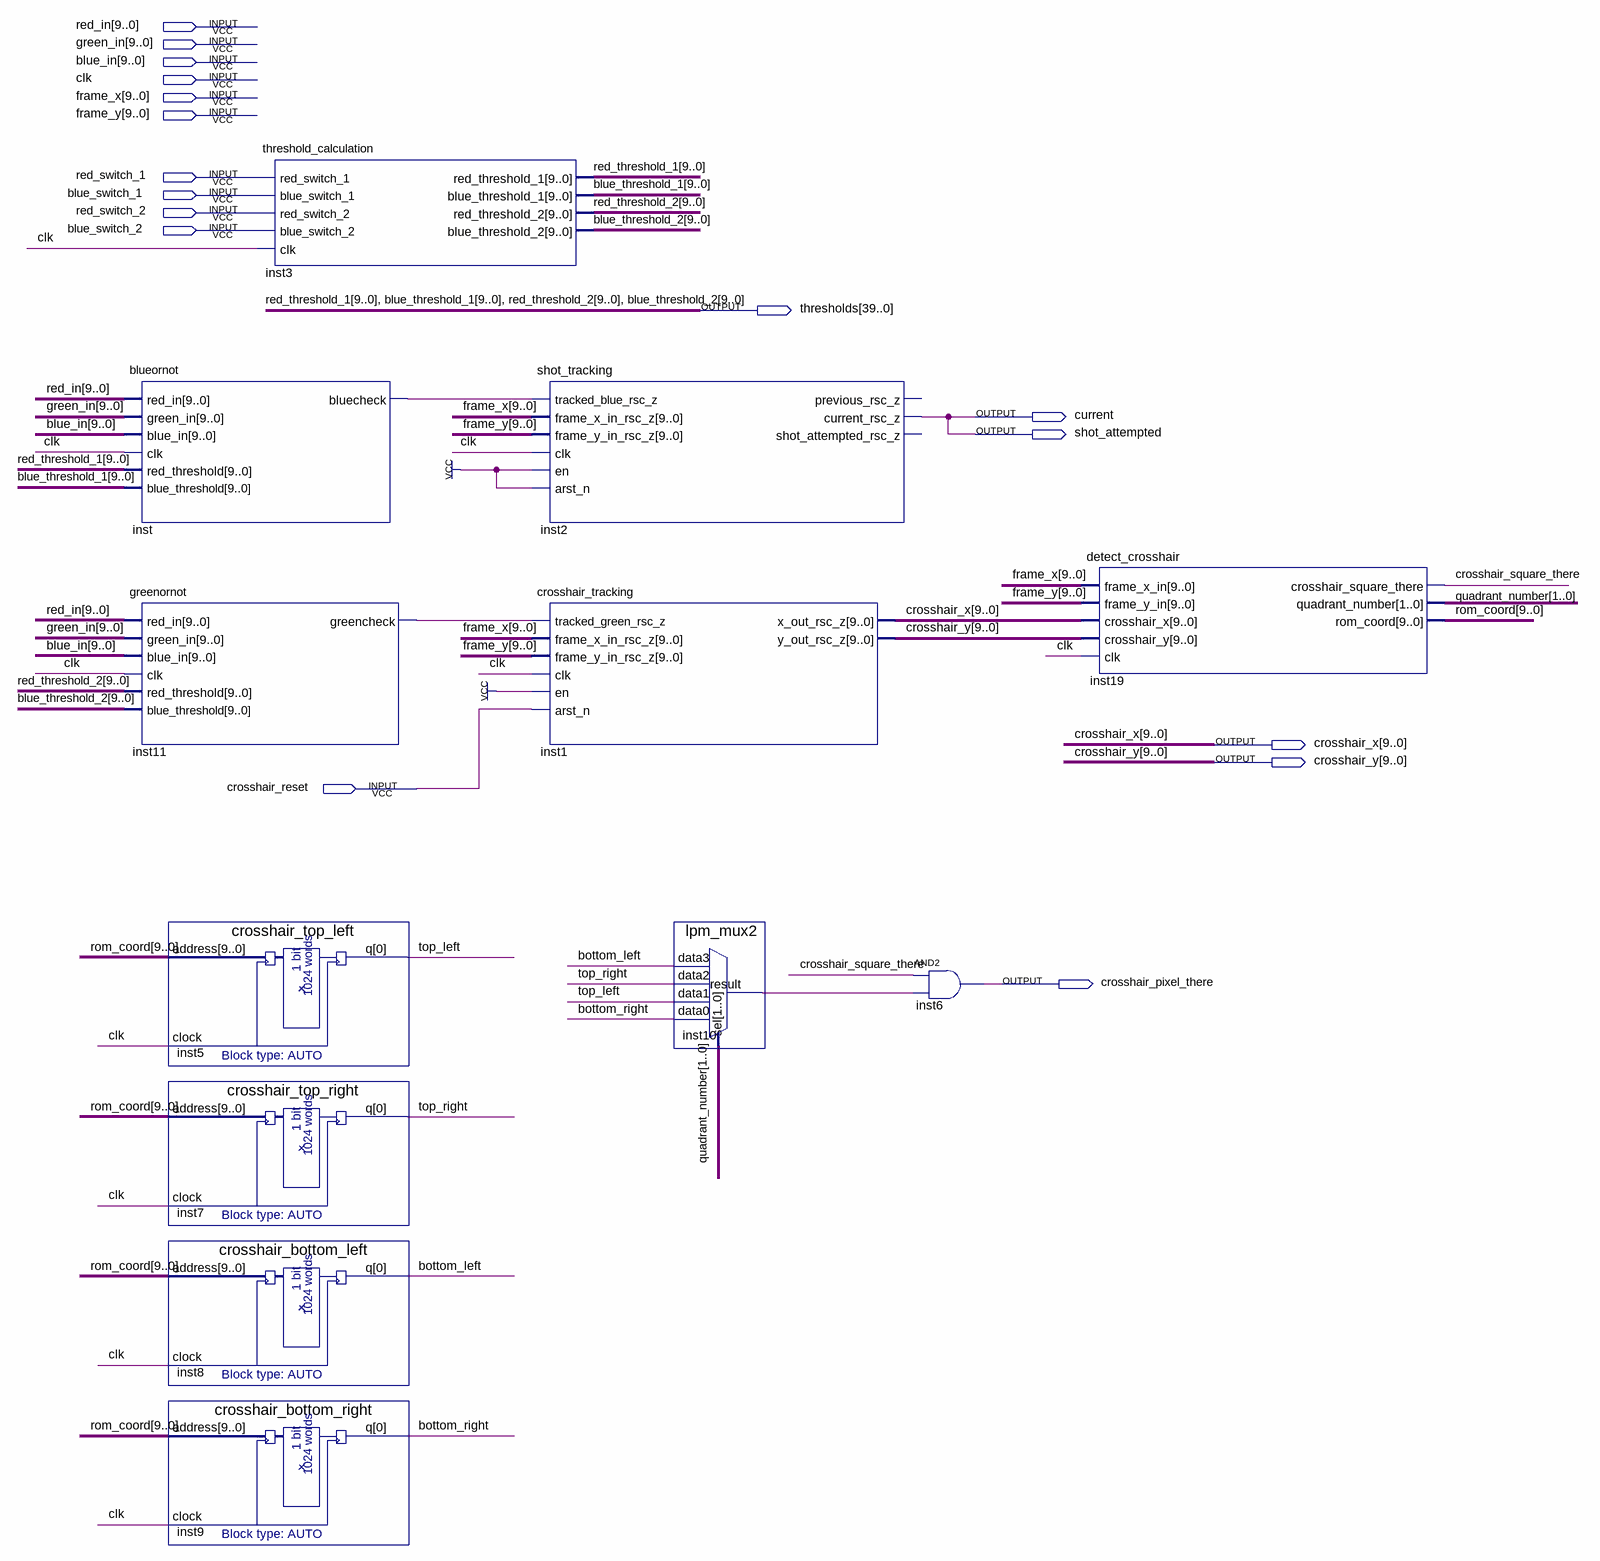
[diagram p0: schematic sheet]
// Quartus schematic tracking_engine.bdf as structural Verilog: 12 symbols, 17 pins
module tracking_engine (
  input  [9:0] red_in,
  input  [9:0] green_in,
  input  [9:0] blue_in,
  input  clk,
  input  [9:0] frame_x,
  input  [9:0] frame_y,
  input  red_switch_1,
  input  blue_switch_1,
  input  red_switch_2,
  input  blue_switch_2,
  input  crosshair_reset,
  output [39:0] thresholds,
  output current,
  output shot_attempted,
  output [9:0] crosshair_x,
  output [9:0] crosshair_y,
  output crosshair_pixel_there
);

  wire bottom_left, bottom_right, crosshair_square_there, inst10_result, inst11_greencheck, inst_bluecheck,
       top_left, top_right;
  wire [1:0] quadrant_number;
  wire [9:0] rom_coord;

  blueornot inst (
    .red_in(red_in), .green_in(green_in), .blue_in(blue_in), .clk(clk), .red_threshold(thresholds[39:30]),
    .blue_threshold(thresholds[29:20]), .bluecheck(inst_bluecheck));
  greenornot inst11 (
    .red_in(red_in), .green_in(green_in), .blue_in(blue_in), .clk(clk), .red_threshold(thresholds[19:10]),
    .blue_threshold(thresholds[9:0]), .greencheck(inst11_greencheck));
  crosshair_top_left inst5 (.address(rom_coord), .clock(clk), .q(top_left));
  crosshair_top_right inst7 (.address(rom_coord), .clock(clk), .q(top_right));
  crosshair_bottom_left inst8 (.address(rom_coord), .clock(clk), .q(bottom_left));
  crosshair_bottom_right inst9 (.address(rom_coord), .clock(clk), .q(bottom_right));
  threshold_calculation inst3 (
    .red_switch_1(red_switch_1), .blue_switch_1(blue_switch_1), .red_switch_2(red_switch_2),
    .blue_switch_2(blue_switch_2), .clk(clk), .red_threshold_1(thresholds[39:30]),
    .blue_threshold_1(thresholds[29:20]), .red_threshold_2(thresholds[19:10]),
    .blue_threshold_2(thresholds[9:0]));
  shot_tracking inst2 (
    .tracked_blue_rsc_z(inst_bluecheck), .frame_x_in_rsc_z(frame_x), .frame_y_in_rsc_z(frame_y), .clk(clk),
    .en(1'b1), .arst_n(1'b1), .current_rsc_z(current));  // open: previous_rsc_z, shot_attempted_rsc_z
  crosshair_tracking inst1 (
    .tracked_green_rsc_z(inst11_greencheck), .frame_x_in_rsc_z(frame_x), .frame_y_in_rsc_z(frame_y),
    .clk(clk), .en(1'b1), .arst_n(crosshair_reset), .x_out_rsc_z(crosshair_x), .y_out_rsc_z(crosshair_y));
  lpm_mux2 inst10 (
    .data3(bottom_left), .data2(top_right), .data1(top_left), .data0(bottom_right), .sel(quadrant_number),
    .result(inst10_result));
  and inst6 (crosshair_pixel_there, crosshair_square_there, inst10_result);
  detect_crosshair inst19 (
    .frame_x_in(frame_x), .frame_y_in(frame_y), .crosshair_x(crosshair_x), .crosshair_y(crosshair_y),
    .clk(clk), .crosshair_square_there(crosshair_square_there), .quadrant_number(quadrant_number),
    .rom_coord(rom_coord));

  assign shot_attempted = current;

  // Other names for the same wires on the sheet: blue_threshold_1[9:0] = thresholds[29:20];
  //   blue_threshold_2[9:0] = thresholds[9:0]; red_threshold_1[9:0] = thresholds[39:30];
  //   red_threshold_2[9:0] = thresholds[19:10]
endmodule
